# Altium schematic sheet Marcelo-v1.SchDoc
size Tabloid
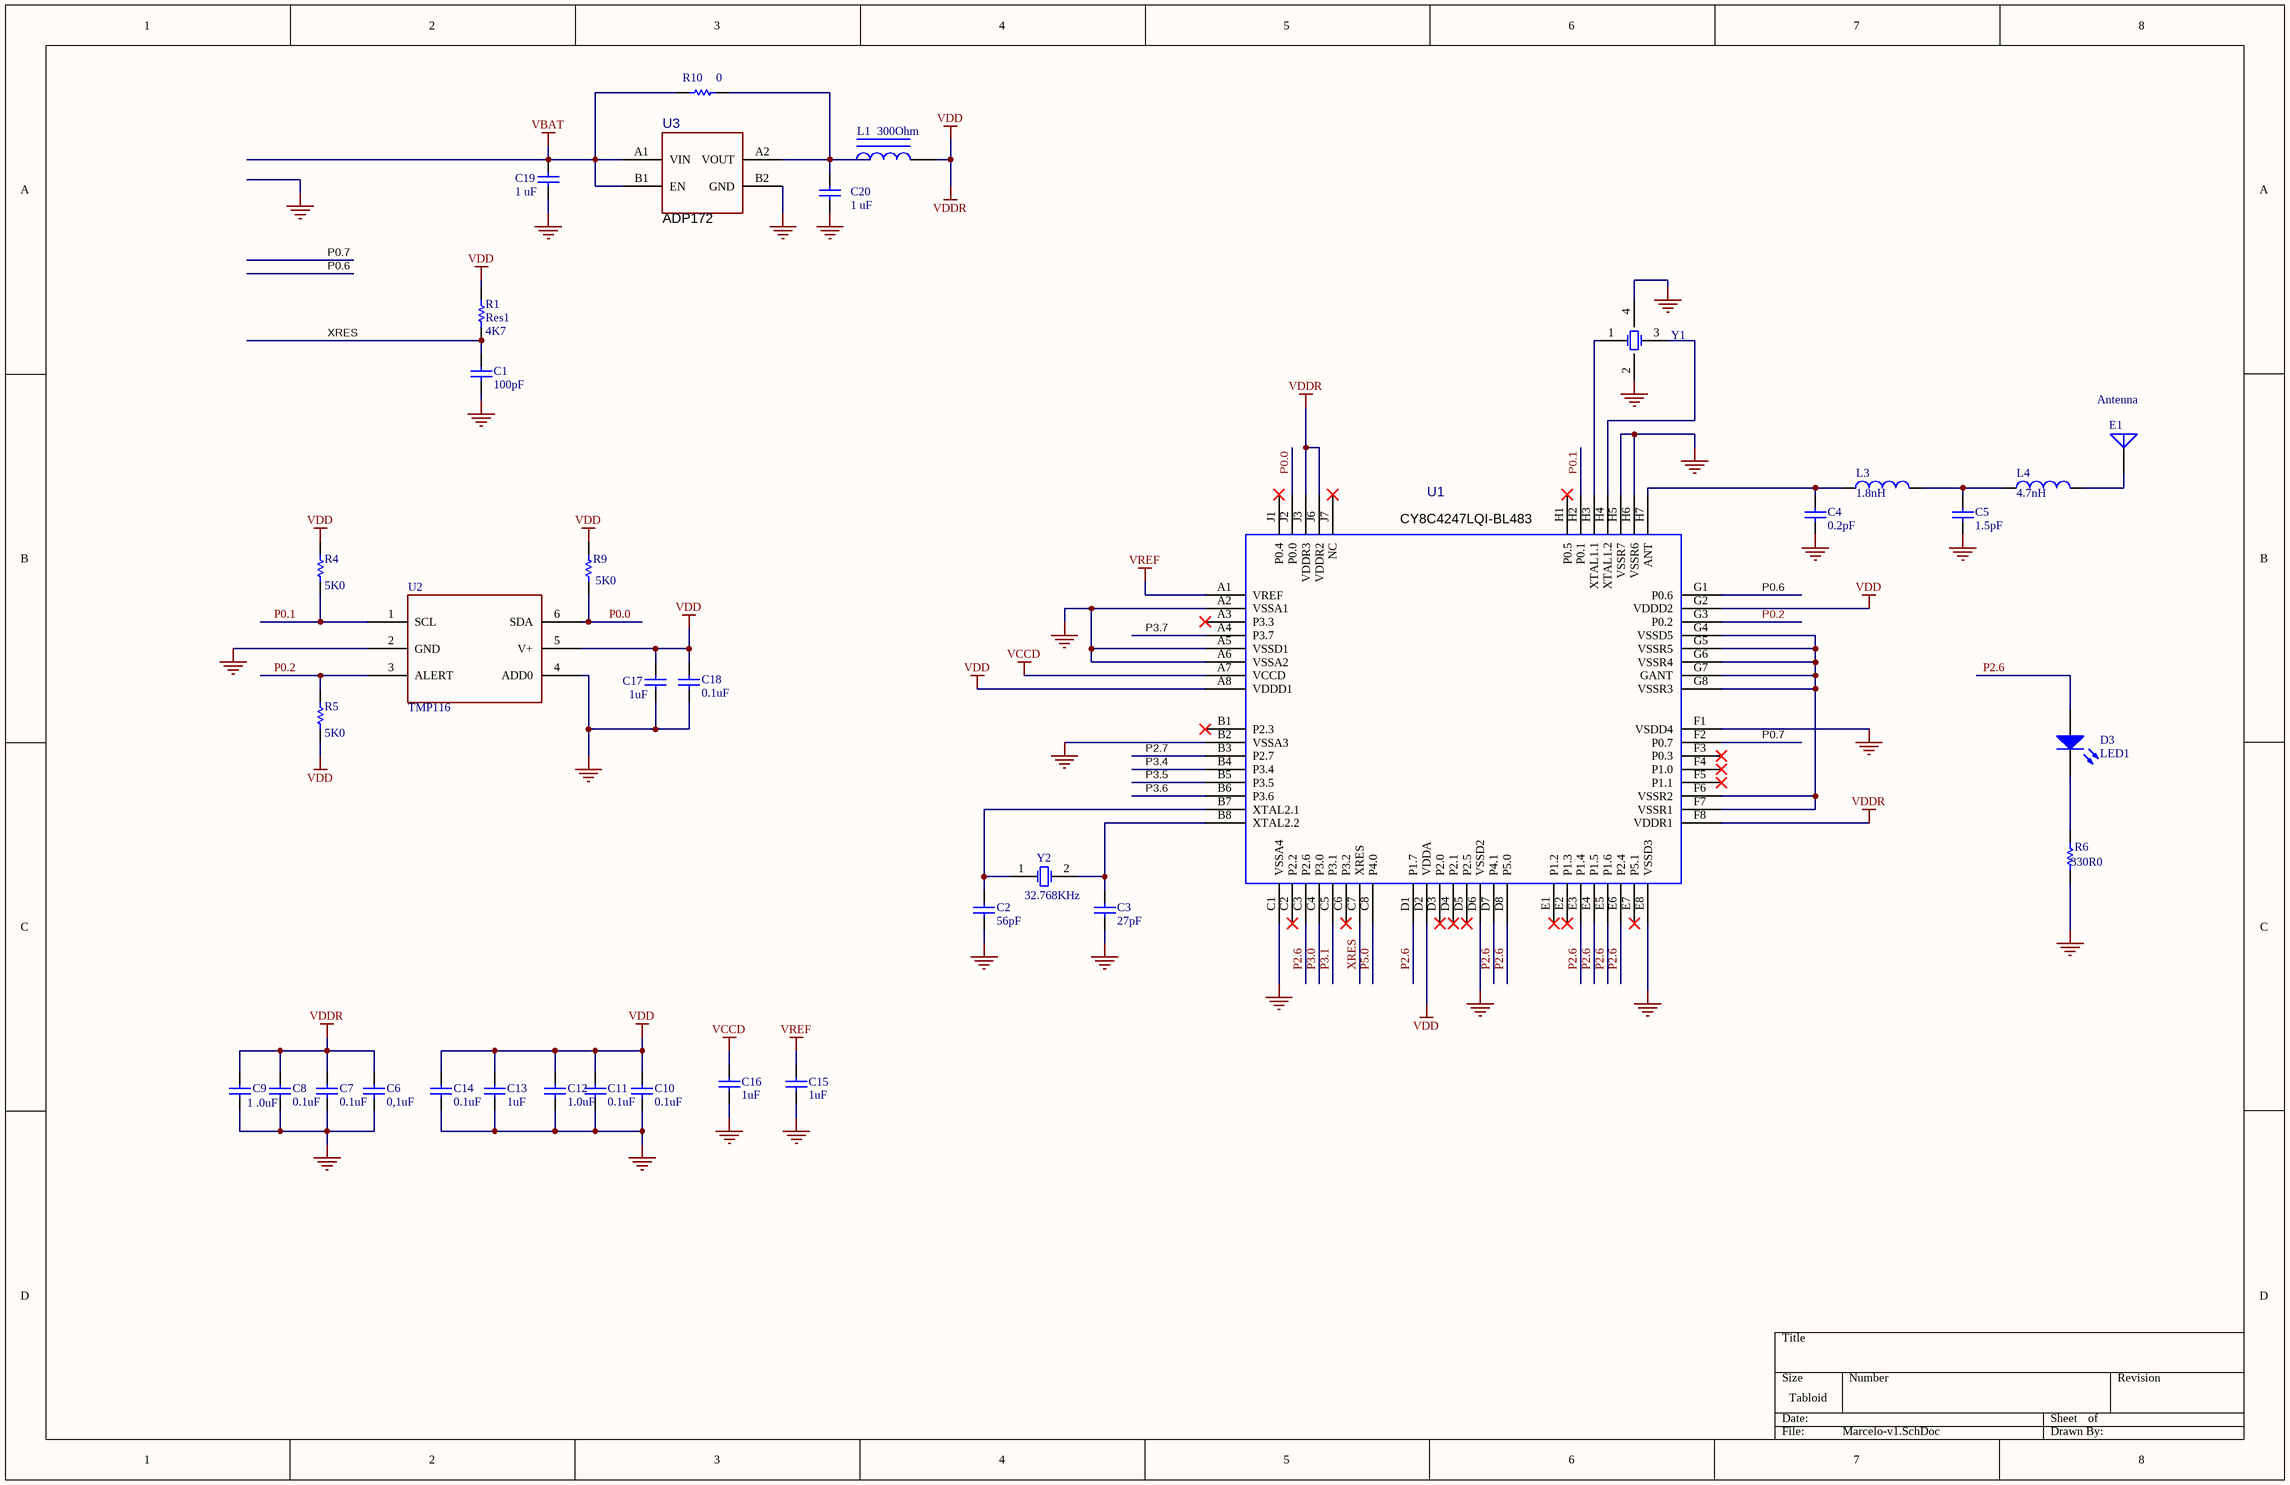
[diagram p0: Marcelo-v1.SchDoc]

## Parts
C1  100pF  [0201]
C2  56pF  [0201]
C3  27pF  [0201]
C4  0.2pF  [0201]
C5  1.5pF  [0201]
C6  0,1uF  [0201]
C7  0.1uF  [0201]
C8  0.1uF  [0201]
C9  1 .0uF  [0201]
C10  0.1uF  [0201]
C11  0.1uF  [0201]
C12  1.0uF  [0201]
C13  1uF  [0201]
C14  0.1uF  [0201]
C15  1uF  [0201]
C16  1uF  [0201]
C17  1uF  [0201]
C18  0.1uF  [0201]
C19  1 uF  [0201]
C20  1 uF  [0201]
D3  LED1  [0402]
E1  Antenna  [ANTENA-YSK]
L1  value 300Ohm  [0201]  (hidden comment: Inductor Iron)
L3  1.8nH  [0201]
L4  value 4.7nH  [0201]  (hidden comment: Inductor)
R1  Res1  value 4K7  [0201]
R4  value 5K0  [0201]  (hidden comment: Res1)
R5  value 5K0  [0201]  (hidden comment: Res1)
R6  value 330R0  [0201]  (hidden comment: Res1)
R9  value 5K0  [0201]  (hidden comment: Res1)
R10  value 0  [0201]  (hidden comment: Res1)
U1  CY8C4247LQI-BL483  [WLCSP-68]
U2  TMP116
U3  ADP172  [ADP172]
Y1  FA-20H  [FA-20H]  (value not drawn)
Y2  32.768KHz  [ABS05]

## Nets
GND: C1.2 C2.2 C3.2 C4.2 C5.2 C6.2 C7.2 C8.2 C9.2 C10.2 C11.2 C12.2 C13.2 C14.2 C15.2 C16.2 C17.1 C18.1 C19.1 C20.1 R6.1 U1.A2(VSSA1) U1.A5(VSSD1) U1.A6(VSSA2) U1.B2(VSSA3) U1.C1(VSSA4) U1.D6(VSSD2) U1.E8(VSSD3) U1.F1(VSDD4) U1.H5(VSSR7) U1.H6(VSSR6) U2.2(GND) U2.4(ADD0) U3.B2(GND) Y1.2(GND) Y1.4(GND)
VBAT: C19.2 R10.2 U3.A1(VIN) U3.B1(EN)
VCCD: C16.1 U1.A7(VCCD)
VDD: C6.1 C7.1 C8.1 C9.1 C10.1 C11.1 C12.1 C13.1 C14.1 C17.2 C18.2 L1.2 R1.2 R4.2 R5.1 R9.2 U1.A8(VDDD1) U1.D2(VDDA) U1.F8(VDDR1) U1.G2(VDDD2) U1.J3(VDDR3) U1.J6(VDDR2) U2.5(V+)  [also labelled VDDR]
VREF: C15.1 U1.A1(VREF)
P0.0: R9.1 U1.J2(P0.0) U2.6(SDA)
P0.1: R4.1 U1.H2(P0.1) U2.1(SCL)
P0.2: R5.2 U1.G3(P0.2) U2.3(ALERT)
P0.6: U1.G1(P0.6)
P0.7: U1.F2(P0.7)
P2.6: D3.1(A) U1.C3(P2.6) U1.D1(P1.7) U1.D7(P4.1) U1.D8(P5.0) U1.E3(P1.4) U1.E4(P1.5) U1.E5(P1.6) U1.E6(P2.4)
P2.7: U1.B3(P2.7)
P3.0: U1.C4(P3.0)
P3.1: U1.C5(P3.1)
P3.4: U1.B4(P3.4)
P3.5: U1.B5(P3.5)
P3.6: U1.B6(P3.6)
P3.7: U1.A4(P3.7)
P5.0: U1.C8(P4.0)
XRES: C1.1 R1.1 U1.C7(XRES)
NetC2_1: C2.1 U1.B7(XTAL2.1) Y2.1(OSC1)
NetC3_1: C3.1 U1.B8(XTAL2.2) Y2.2(OSC2)
NetC4_1: C4.1 L3.1 U1.H7(ANT)
NetC5_1: C5.1 L3.2 L4.1
NetC20_2: C20.2 L1.1 R10.1 U3.A2(VOUT)
NetD3_2: D3.2(K) R6.2
NetE1_1: E1.1(A) L4.2
NetU1_F6: U1.F6(VSSR2) U1.F7(VSSR1) U1.G4(VSSD5) U1.G5(VSSR5) U1.G6(VSSR4) U1.G7(GANT) U1.G8(VSSR3)
NetU1_H3: U1.H3(XTAL1.1) Y1.1(OSC1)
NetU1_H4: U1.H4(XTAL1.2) Y1.3(OSC2)

Not connected (* = marked no-connect by the designer): U1 A3(P3.3)* B1(P2.3)* C2(P2.2)* C6(P3.2)* D3(P2.0)* D4(P2.1)* D5(P2.5)* E1(P1.2)* E2(P1.3)* E7(P5.1)* F3(P0.3)* F4(P1.0)* F5(P1.1)* H1(P0.5)* J1(P0.4)* J7(NC)*

## Library data of the parts
C1 = Cap: Capacitor; Published: 8-Jun-2000; LatestRevisionDate: 17-Jul-2002; LatestRevisionNote: Re-released for DXP Platform.; PackageReference: RAD-0.3; Publisher: Altium Limited; Value: 100pF
C2-C18 = Cap: Capacitor; Value: 100pF; Published: 8-Jun-2000; LatestRevisionDate: 17-Jul-2002; LatestRevisionNote: Re-released for DXP Platform.; PackageReference: RAD-0.3; Publisher: Altium Limited
C19 C20 = Cap: Capacitor 1608-1155-1-ND X7R 1812; Value: 100pF; Published: 8-Jun-2000; LatestRevisionDate: 17-Jul-2002; LatestRevisionNote: Re-released for DXP Platform.; PackageReference: RAD-0.3; Publisher: Altium Limited
D3 = LED1: Typical RED GaAs LED; Published: 8-Jun-2000; LatestRevisionDate: 08-Jul-2005; LatestRevisionNote: Mech Layer 1 removed.; PackageReference: LED-1; Publisher: Altium Limited
E1 = Antenna: Generic Antenna; Published: 24-Mar-1999; LatestRevisionDate: 17-Jul-2002; LatestRevisionNote: Re-released for DXP Platform.; PackageReference: PIN1; Publisher: Altium Limited
L1 = Inductor Iron: Magnetic-Core Inductor; Published: 24-Mar-1999; LatestRevisionDate: 17-Jul-2002; LatestRevisionNote: Re-released for DXP Platform.; PackageReference: AXIAL-0.9; Publisher: Altium Limited
L3 L4 = Inductor: Code_IEC: 1005; Published: 8-Jun-2000; LatestRevisionDate: 17-Jul-2002; LatestRevisionNote: Re-released for DXP Platform.; PackageReference: 0402-A; Publisher: Altium Limited; Code_JEITA: 0402
  L3: Value: 1.8nH
R1 R4-R6 R9 R10 = Res1: Resistor; Published: 8-Jun-2000; LatestRevisionDate: 17-Jul-2002; LatestRevisionNote: Re-released for DXP Platform.; PackageReference: SMD0201; Publisher: Altium Limited
U1 = CYBL10X6X
Y2 = XTAL: Crystal Oscillator; Published: 8-Jun-2000; LatestRevisionDate: 17-Jul-2002; LatestRevisionNote: Re-released for DXP Platform.; PackageReference: R38; Publisher: Altium Limited